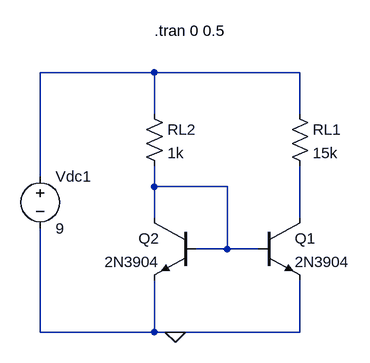
[diagram p0: schematic CurrentSource2.asc]
CurrentSource2.asc, the LTspice schematic file:
Version 4
SHEET 1 880 680
WIRE 400 128 224 128
WIRE 624 128 400 128
WIRE 400 192 400 128
WIRE 624 192 624 128
WIRE 224 288 224 128
WIRE 400 304 400 272
WIRE 512 304 400 304
WIRE 400 352 400 304
WIRE 624 352 624 272
WIRE 512 400 512 304
WIRE 512 400 464 400
WIRE 560 400 512 400
WIRE 224 528 224 368
WIRE 400 528 400 448
WIRE 400 528 224 528
WIRE 432 528 400 528
WIRE 624 528 624 448
WIRE 624 528 432 528
FLAG 432 528 0
SYMBOL npn 560 352 R0
SYMATTR InstName Q1
SYMATTR Value 2N3904
SYMBOL voltage 224 272 R0
SYMATTR InstName Vdc1
SYMATTR Value 9
SYMBOL res 608 176 R0
SYMATTR InstName RL1
SYMATTR Value 15k
SYMBOL npn 464 352 M0
SYMATTR InstName Q2
SYMATTR Value 2N3904
SYMBOL res 384 176 R0
SYMATTR InstName RL2
SYMATTR Value 1k
TEXT 400 64 Left 2 !.tran 0 0.5

The netlist it stands for:
* CurrentSource2.asc
Q1 N003 N002 0 0 2N3904
Vdc1 N001 0 9
RL1 N001 N003 15k
Q2 N002 N002 0 0 2N3904
RL2 N001 N002 1k
.model NPN NPN
.model PNP PNP
.lib standard.bjt
.tran 0 0.5
.backanno
.end